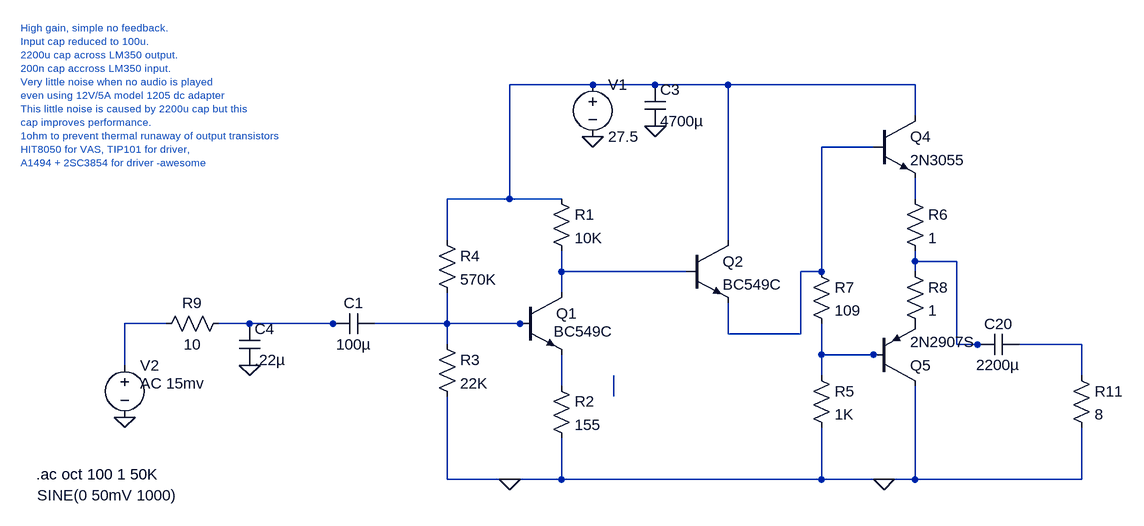
[diagram p0: schematic Simplest circuti that works best so far - no feedback - no bypass caps.asc]
Simplest circuti that works best so far - no feedback - no bypass caps.asc, the LTspice schematic file:
Version 4
SHEET 1 1788 680
WIRE 272 -256 144 -256
WIRE 368 -256 272 -256
WIRE 480 -256 368 -256
WIRE 768 -256 480 -256
WIRE 768 -208 768 -256
WIRE 704 -160 624 -160
WIRE 144 -80 144 -256
WIRE 144 -80 48 -80
WIRE 224 -80 144 -80
WIRE 768 -80 768 -112
WIRE 48 -16 48 -80
WIRE 480 -16 480 -256
WIRE 768 16 768 0
WIRE 832 16 768 16
WIRE 224 32 224 0
WIRE 416 32 224 32
WIRE 624 32 624 -160
WIRE 624 32 592 32
WIRE 768 32 768 16
WIRE 224 64 224 32
WIRE -384 112 -448 112
WIRE -256 112 -304 112
WIRE -128 112 -256 112
WIRE -112 112 -128 112
WIRE 48 112 48 64
WIRE 48 112 -64 112
WIRE 160 112 48 112
WIRE 176 112 160 112
WIRE 480 128 480 80
WIRE 592 128 592 32
WIRE 592 128 480 128
WIRE 48 144 48 112
WIRE 832 144 832 16
WIRE 864 144 832 144
WIRE 880 144 864 144
WIRE 1024 144 928 144
WIRE 624 160 624 112
WIRE 704 160 624 160
WIRE 720 160 704 160
WIRE -448 176 -448 112
WIRE 624 192 624 160
WIRE 1024 192 1024 144
WIRE 224 208 224 160
WIRE 304 224 304 192
WIRE 48 352 48 224
WIRE 144 352 48 352
WIRE 224 352 224 288
WIRE 224 352 144 352
WIRE 624 352 624 272
WIRE 624 352 224 352
WIRE 720 352 624 352
WIRE 768 352 768 208
WIRE 768 352 720 352
WIRE 1024 352 1024 272
WIRE 1024 352 768 352
FLAG 272 -176 0
FLAG 144 352 0
FLAG -448 256 0
FLAG 720 352 0
FLAG -256 176 0
FLAG 368 -192 0
SYMBOL npn 160 64 R0
WINDOW 3 52 60 Left 2
SYMATTR Value BC549C
SYMATTR InstName Q1
SYMBOL res 208 -96 R0
SYMATTR InstName R1
SYMATTR Value 10K
SYMBOL voltage 272 -272 R0
WINDOW 123 0 0 Left 2
WINDOW 39 0 0 Left 2
SYMATTR InstName V1
SYMATTR Value 27.5
SYMBOL res 32 -32 R0
SYMATTR InstName R4
SYMATTR Value 570K
SYMBOL res 32 128 R0
SYMATTR InstName R3
SYMATTR Value 22K
SYMBOL res 208 192 R0
SYMATTR InstName R2
SYMATTR Value 155
SYMBOL cap -64 96 R90
WINDOW 0 0 32 VBottom 2
WINDOW 3 32 32 VTop 2
SYMATTR InstName C1
SYMATTR Value 100µ
SYMBOL voltage -448 160 R0
WINDOW 123 24 44 Left 2
WINDOW 39 24 72 Left 2
WINDOW 3 -135 216 Left 2
SYMATTR Value2 AC 15mv
SYMATTR Value SINE(0 50mV 1000)
SYMATTR InstName V2
SYMBOL npn2 704 -208 R0
SYMATTR InstName Q4
SYMATTR Value 2N3055
SYMBOL res 1008 176 R0
SYMATTR InstName R11
SYMATTR Value 8
SYMBOL pnp 704 208 M180
SYMATTR InstName Q5
SYMATTR Value 2N2907S
SYMBOL cap 928 128 R90
WINDOW 0 0 32 VBottom 2
WINDOW 3 32 32 VTop 2
SYMATTR InstName C20
SYMATTR Value 2200µ
SYMBOL res 608 176 R0
SYMATTR InstName R5
SYMATTR Value 1K
SYMBOL res 608 16 R0
SYMATTR InstName R7
SYMATTR Value 109
SYMBOL npn 416 -16 R0
SYMATTR InstName Q2
SYMATTR Value BC549C
SYMBOL res -288 96 R90
WINDOW 0 0 56 VBottom 2
WINDOW 3 32 56 VTop 2
SYMATTR InstName R9
SYMATTR Value 10
SYMBOL cap -272 112 R0
SYMATTR InstName C4
SYMATTR Value .22µ
SYMBOL cap 352 -256 R0
SYMATTR InstName C3
SYMATTR Value 4700µ
SYMBOL res 752 -96 R0
SYMATTR InstName R6
SYMATTR Value 1
SYMBOL res 752 16 R0
SYMATTR InstName R8
SYMATTR Value 1
TEXT -584 344 Left 2 !.ac oct 100 1 50K
TEXT -608 -344 Left 1 ;High gain, simple no feedback.\nInput cap reduced to 100u.\n2200u cap across LM350 output.\n200n cap accross LM350 input.\nVery little noise when no audio is played\neven using 12V/5A model 1205 dc adapter\nThis little noise is caused by 2200u cap but this\ncap improves performance.\n1ohm to prevent thermal runaway of output transistors\nHIT8050 for VAS, TIP101 for driver,\nA1494 + 2SC3854 for driver -awesome

The netlist it stands for:
* Simplest circuti that works best so far - no feedback - no bypass caps.asc
Q1 N005 N008 N011 0 BC549C
R1 N001 N005 10K
V1 N001 0 27.5
R4 N001 N008 570K
R3 N008 0 22K
R2 N011 0 155
C1 N008 N007 100µ
V2 N006 0 SINE(0 50mV 1000) AC 15mv
Q4 N001 N002 N003 0 2N3055
R11 N009 0 8
Q5 0 N010 P001 0 2N2907S
C20 N009 N004 2200µ
R5 N010 0 1K
R7 N002 N010 109
Q2 N001 N005 N002 0 BC549C
R9 N007 N006 10
C4 N007 0 .22µ
C3 N001 0 4700µ
R6 N003 N004 1
R8 N004 P001 1
.model NPN NPN
.model PNP PNP
.lib standard.bjt
.ac oct 100 1 50K
* High gain, simple no feedback.
* Input cap reduced to 100u.
* 2200u cap across LM350 output.
* 200n cap accross LM350 input.
* Very little noise when no audio is played
* even using 12V/5A model 1205 dc adapter
* This little noise is caused by 2200u cap but this
* cap improves performance.
* 1ohm to prevent thermal runaway of output transistors
* HIT8050 for VAS, TIP101 for driver,
* A1494 + 2SC3854 for driver -awesome
.backanno
.end